# Altium schematic sheet HS_LS_switch_HI_PWR.SchDoc: Data Logger - HS LS HI Power Switches
size A4; DocumentNumber: DL-MB-7; SheetNumber: 7; SheetTotal: 11
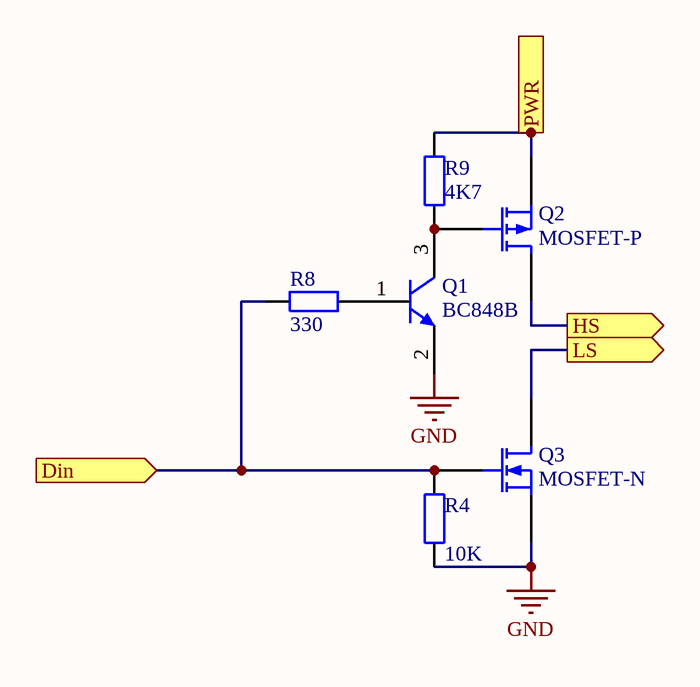
[diagram p0: HS_LS_switch_HI_PWR.SchDoc]

## Parts
Q1  BC848B  [SOT23_N]
Q2  MOSFET-P  [TO-220AB_PMOS_TABDOWN]
Q3  MOSFET-N  [TO-220AB_NMOS_TABDOWN]
R4  10K  [RES-1206_M]
R8  330  [RES-1206_M]
R9  4K7  [RES-1206_M]

## Ports
Din (in), HS (out), LS (out), PWR (in)

## Nets
GND: Q1.2(E) Q3.3(S) R4.1
Din: Q3.1(G) R4.2 R8.1 ; port Din
HS: Q2.2(D) ; port HS
LS: Q3.2(D) ; port LS
PWR: Q2.3(S) R9.2 ; port PWR
NetQ1_1: Q1.1(B) R8.2
NetQ1_3: Q1.3(C) Q2.1(G) R9.1

## Notes on the sheet
- Title
- Size
- Date:
- A4
- Number
- Time:
- Sheet
- of
- Revision
- File:
- Drawn By:

## Library data of the parts
Q1 = BC848B: NPN Silicon AF Transistor, 30 V VCEO, 100 mA IC, SOT23, Reel, Green; Manufacturer: Infineon; fT (typ): 250 MHz; Green: TRUE; IBM (max): 200 mA; IC (max): 100 mA; ICBO (max): 15 nA; Ptot (max): 330 mW; VCBO (max): 30 V; VEBO (max): 6 V; PackageVersion: Apr-08; PackageReference: SOT23; PackageDescription: 3-Pin Small Outline Transistor Package, 1.3 x 2.9 mm Body, 0.95 mm Pitch; ICM (max): 200 mA; Packing: Reel; Polarity: NPN; VCEO (max): 30 V; Mounting Technology: Surface Mount; PartNumber: BC848B; ComponentLink1Description: Manufacturer URL; ComponentLink1URL: http://www.infineon.com/; ComponentLink2Description: Datasheet; ComponentLink2URL: http://www.infineon.com/dgdl/bc847series_bc848series_bc849series_bc850series.pdf?folderId=db3a304314dca389011541d30fa21656&fileId=db3a304314dca389011541d4630a1657; ComponentLink3Description: Package Specification; ComponentLink3URL: http://www.infineon.com/dgdl/SOT23-Package_Overview.pdf?folderId=db3a30431936bc4b0119532290053c66&fileId=db3a30431936bc4b0119533468123c85
Q2 = MOSFET-P: P-Channel MOSFET; PackageVersion: 1995/1996; PackageReference: TO-220AB; PackageDescription: TO, Thru-Hole; 3 In-Line Leads; Pitch 2.54 mm
Q3 = MOSFET-N: N-Channel MOSFET; PackageVersion: 1995/1996; PackageReference: TO-220AB; PackageDescription: TO, Thru-Hole; 3 In-Line Leads; Pitch 2.54 mm
R4 R8 R9 = Res2: Resistor; Published: 8-Jun-2000; LatestRevisionDate: 17-Jul-2002; LatestRevisionNote: Re-released for DXP Platform.; PackageReference: 1206; Publisher: Altium Limited; PackageDescription: Chip Resistor 1206 Case Size
  R4: Value: 10K
  R8: Value: 330
  R9: Value: 4K7